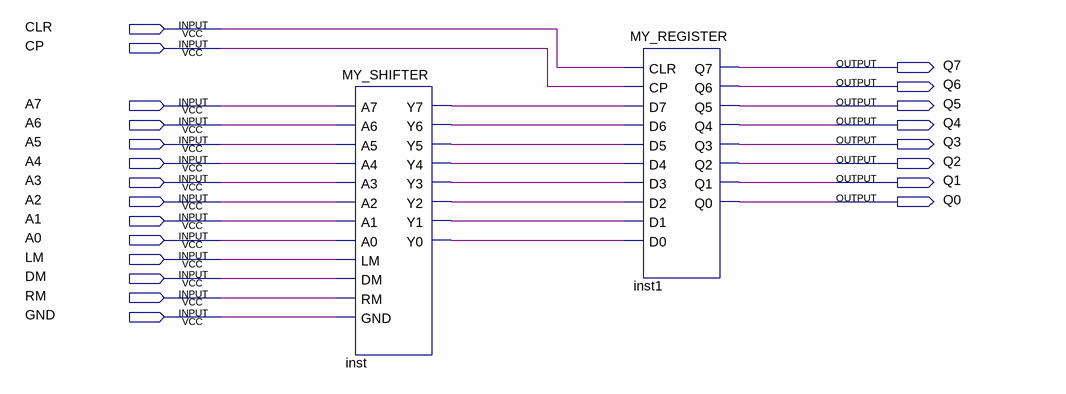
[diagram p0: schematic sheet]
// Quartus schematic MY_SHIFREGISTER.bdf as structural Verilog: 2 symbols, 22 pins
module MY_SHIFREGISTER (
  input  CLR,
  input  CP,
  input  A7,
  input  A6,
  input  A5,
  input  A4,
  input  A3,
  input  A2,
  input  A1,
  input  A0,
  input  LM,
  input  DM,
  input  RM,
  input  GND,
  output Q7,
  output Q6,
  output Q5,
  output Q4,
  output Q3,
  output Q2,
  output Q1,
  output Q0
);

  wire inst_y0, inst_y1, inst_y2, inst_y3, inst_y4, inst_y5, inst_y6, inst_y7;

  MY_SHIFTER inst (
    .A7(A7), .A6(A6), .A5(A5), .A4(A4), .A3(A3), .A2(A2), .A1(A1), .A0(A0), .LM(LM), .DM(DM), .RM(RM),
    .GND(GND), .Y7(inst_y7), .Y6(inst_y6), .Y5(inst_y5), .Y4(inst_y4), .Y3(inst_y3), .Y2(inst_y2),
    .Y1(inst_y1), .Y0(inst_y0));
  MY_REGISTER inst1 (
    .CLR(CLR), .CP(CP), .D7(inst_y7), .D6(inst_y6), .D5(inst_y5), .D4(inst_y4), .D3(inst_y3), .D2(inst_y2),
    .D1(inst_y1), .D0(inst_y0), .Q7(Q7), .Q6(Q6), .Q5(Q5), .Q4(Q4), .Q3(Q3), .Q2(Q2), .Q1(Q1), .Q0(Q0));
endmodule
